# EasyEDA Pro project ProPrj_两相交错电源demo_2025-05-26.epro, board PCB1_1
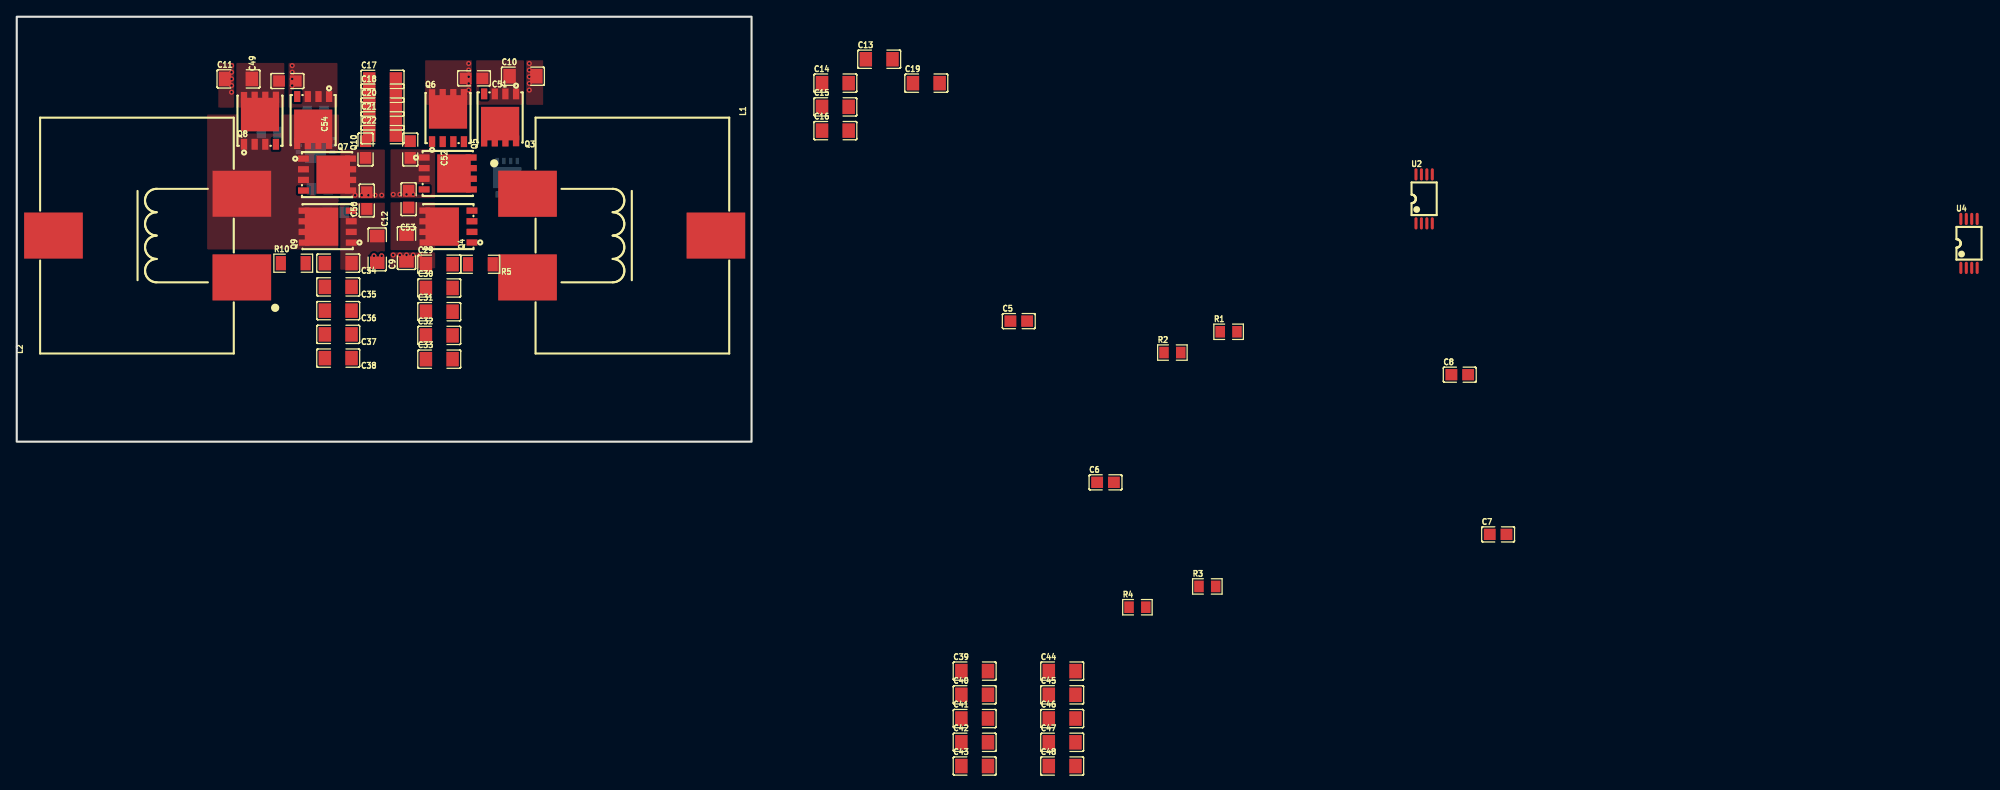
[diagram p9: board, top side]
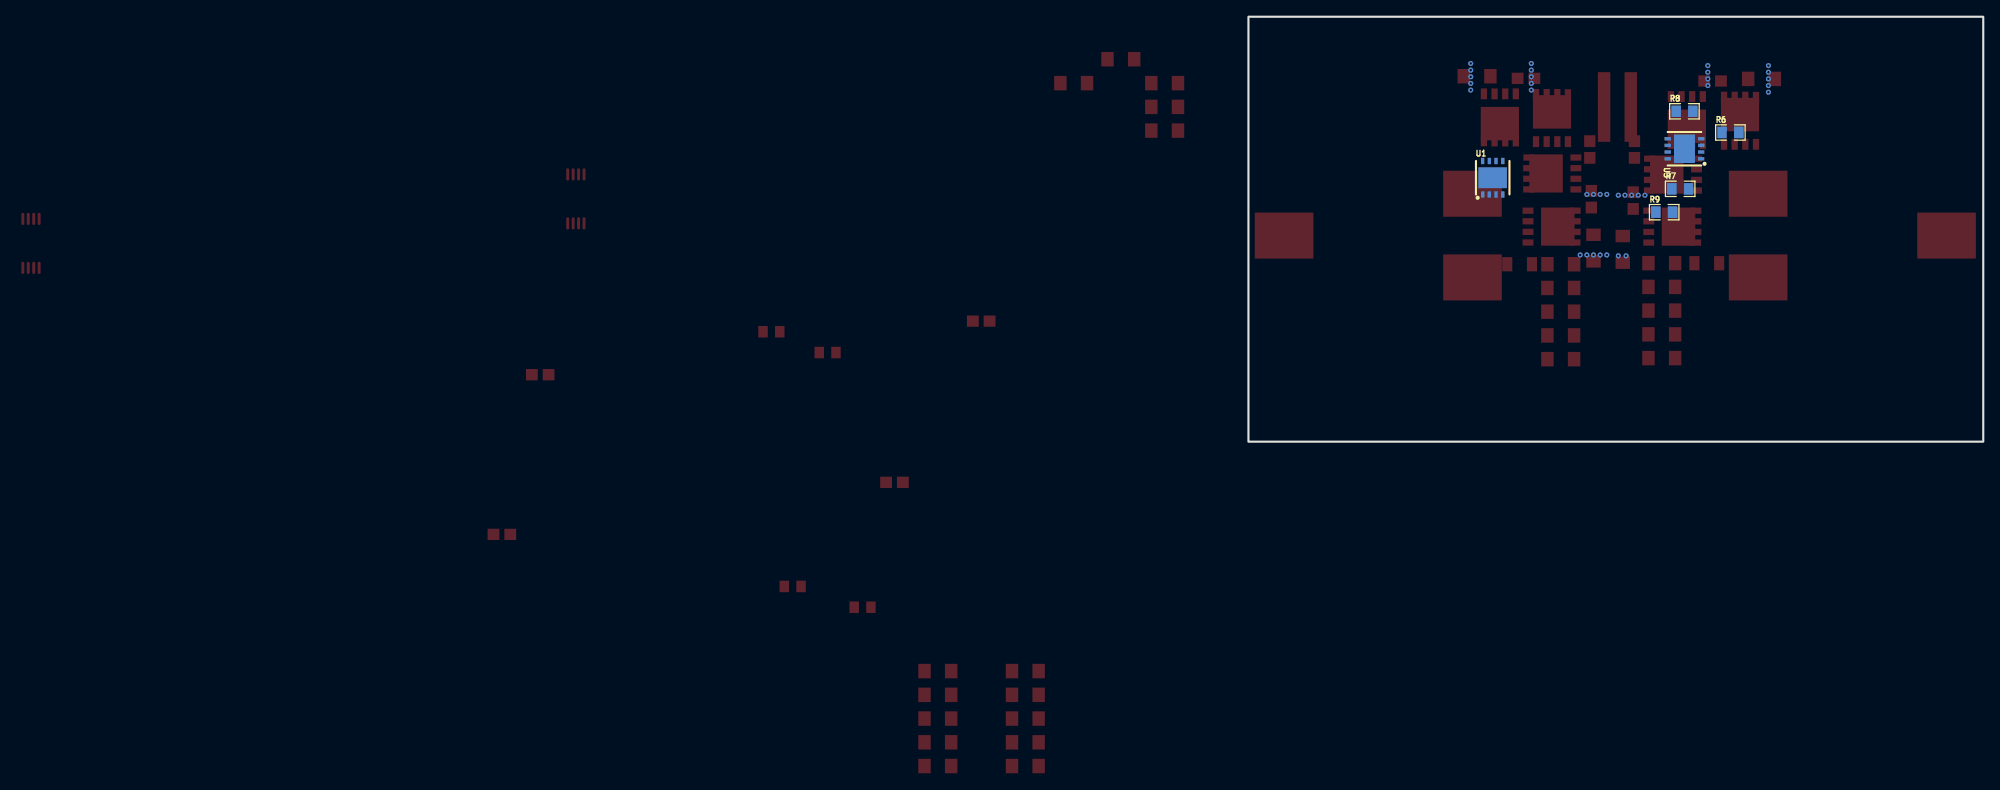
[diagram p10: board, bottom side, seen from below]

Outline 87.76 x 50.8 mm; copper layers: Top Layer, Inner1, Inner2, Bottom Layer. Coordinates in mm from the lower left corner of the outline.
Outline path: rectangle 0,50.8 87.76,0
Stack: Top Layer 0.035mm 外层铜厚1oz / Dielectric1 0.2104mm 7628 RC49% 8.6mil / Inner1 0.0152mm 内层铜厚 / Dielectric2 1.065mm 1.1mm H/HOZ Copper / Inner2 0.0152mm 内层铜厚 / Dielectric3 0.2104mm 7628 RC49% 8.6mil / Bottom Layer 0.035mm 外层铜厚1oz

## Design rules (mm)
template: 自定义配置
spacing copperThickness1oz (default): track to track 0.102, other pairs 0.152 to 0.3
spacing copperThickness2oz: track to track 0.203, other pairs 0.152 to 0.3
track width copperThickness1oz (default): min 0.127, default 0.254, max 2.54
track width copperThickness2oz: min 0.203, default 0.254, max 2.54
differential pair differentialPair (default): width min 0.127, default 0.254, max 2.54; gap min 0.152, default 0.152
via viaSize (default): diameter min 0.5, default 0.61, max 10; hole min 0.3, default 0.305, max 6.3

## Placement (name value [footprint] x y rotation side)
C5  100nF  [C0805]  119.67 14.41 0 top
C6  1uF  [C0805]  130.03 -4.86 0 top
C7  1uF  [C0805]  176.92 -11.08 0 top
C8  100nF  [C0805]  172.34 8.01 0 top
C9  100nF  [C1206]  46.55 23.15 90 top
C10  100nF  [C1206]  60.45 43.69 0 top
C11  100nF  [C1206]  26.48 43.37 0 top
C12  100nF  [C1206]  43.05 22.99 270 top
C13  100nF  [C1206]  103 45.72 0 top
C14  100nF  [C1206]  97.77 42.86 0 top
C15  100nF  [C1206]  97.77 40.02 0 top
C16  100nF  [C1206]  97.77 37.19 0 top
C17  100nF  [C1206]  43.69 43.31 0 top
C18  100nF  [C1206]  43.69 41.66 0 top
C19  100nF  [C1206]  108.62 42.86 0 top
C20  100nF  [C1206]  43.69 40 0 top
C21  100nF  [C1206]  43.69 38.35 0 top
C22  100nF  [C1206]  43.69 36.7 0 top
C29  100nF  [C1206]  50.46 21.21 0 top
C30  100nF  [C1206]  50.46 18.38 0 top
C31  100nF  [C1206]  50.46 15.54 0 top
C32  100nF  [C1206]  50.46 12.7 0 top
C33  100nF  [C1206]  50.46 9.86 0 top
C34  100nF  [C1206]  38.39 21.34 180 top
C35  100nF  [C1206]  38.39 18.5 180 top
C36  100nF  [C1206]  38.39 15.67 180 top
C37  100nF  [C1206]  38.39 12.83 180 top
C38  100nF  [C1206]  38.39 9.99 180 top
C39  100nF  [C1206]  114.4 -27.43 0 top
C40  100nF  [C1206]  114.4 -30.26 0 top
C41  100nF  [C1206]  114.4 -33.1 0 top
C42  100nF  [C1206]  114.4 -35.94 0 top
C43  100nF  [C1206]  114.4 -38.78 0 top
C44  100nF  [C1206]  124.85 -27.43 0 top
C45  100nF  [C1206]  124.85 -30.26 0 top
C46  100nF  [C1206]  124.85 -33.1 0 top
C47  100nF  [C1206]  124.85 -35.94 0 top
C48  100nF  [C1206]  124.85 -38.78 0 top
C49  2.2uF  [C0805]  32.32 43.11 180 top
C50  2.2uF  [C0805]  41.81 28.82 90 top
C51  2.2uF  [C0805]  54.61 43.43 180 top
C52  2.2uF  [C0805]  46.99 34.92 90 top
C53  2.2uF  [C0805]  46.8 28.99 270 top
C54  2.2uF  [C0805]  41.66 34.92 270 top
L1  15uH  [IND-SMD_3P-L28.0-W27.0_1]  71.5 24.64 270 top
L2  15uH  [IND-SMD_3P-L28.0-W27.0_1]  16.38 24.64 90 top
Q3  BSC026N08NS5  [PG-TDSON-8_L5.0-W6.0-P1.27-BL-EP]  57.73 38.76 180 top
Q4  BSC026N08NS5  [PG-TDSON-8_L5.0-W6.0-P1.27-BL-EP]  51.55 25.71 90 top
Q5  BSC026N08NS5  [PG-TDSON-8_L5.0-W6.0-P1.27-BL-EP]  51.48 32.06 270 top
Q6  BSC026N08NS5  [PG-TDSON-8_L5.0-W6.0-P1.27-BL-EP]  51.51 38.69 0 top
Q7  BSC026N08NS5  [PG-TDSON-8_L5.0-W6.0-P1.27-BL-EP]  35.4 38.44 180 top
Q8  BSC026N08NS5  [PG-TDSON-8_L5.0-W6.0-P1.27-BL-EP]  29.05 38.37 0 top
Q9  BSC026N08NS5  [PG-TDSON-8_L5.0-W6.0-P1.27-BL-EP]  37.13 25.71 90 top
Q10  BSC026N08NS5  [PG-TDSON-8_L5.0-W6.0-P1.27-BL-EP]  37.06 31.93 270 top
R1  4.7Ω  [R0805]  144.73 13.14 0 top
R2  4.7Ω  [R0805]  138.02 10.65 0 top
R3  4.7Ω  [R0805]  142.19 -17.3 0 top
R4  4.7Ω  [R0805]  133.84 -19.79 0 top
R5  1mΩ  [R1206]  55.37 21.21 180 top
R6  4.7Ω  [R0805]  30.2 36.96 180 bottom
R7  4.7Ω  [R0805]  36.2 30.23 180 bottom
R8  4.7Ω  [R0805]  35.69 39.5 180 bottom
R9  4.7Ω  [R0805]  38.11 27.43 180 bottom
R10  1mΩ  [R1206]  33.02 21.34 0 top
U1  UCC27211DRMT  [VSON-8_L4.0-W4.0-BL-EP]  58.58 31.55 180 bottom
U2  INA240A1QPWRQ1  [TSSOP-8_L4.4-W3.0-P0.65-LS6.4-BL]  168.08 29.03 0 top
U3  UCC27211DRMT  [VSON-8_L4.0-W4.0-BL-EP]  35.68 35.02 90 bottom
U4  INA240A1QPWRQ1  [TSSOP-8_L4.4-W3.0-P0.65-LS6.4-BL]  233.16 23.7 0 top

## Footprints (pads in the part's own frame, mm; a bottom-side part is the same pattern mirrored in y, then rotated)
C0805
  rect 1.41x1.35 smd: 1(-1,0) 2(1,0)
C1206
  rect 1.485x1.728 smd: 1(-1.593,0) 2(1.593,0)
IND-SMD_3P-L28.0-W27.0_1
  rect 5.5x7 smd: 1(-5,-10.5) 2(5,-10.5) 3(0,12)
PG-TDSON-8_L5.0-W6.0-P1.27-BL-EP
  rect 0.75x1.3 smd: 1(-1.905,-2.82) 2(-0.635,-2.82) 3(0.635,-2.82) 4(1.905,-2.82) 5(1.905,2.82) 6(0.635,2.82) 7(-0.635,2.82) 8(-1.905,2.794)
  rect 4.56x4 smd: 8(0,0.737)
R0805
  rect 1.133x1.377 smd: 1(-1,0) 2(1,0)
R1206
  rect 1.208x1.701 smd: 1(-1.479,0) 2(1.479,0)
TSSOP-8_L4.4-W3.0-P0.65-LS6.4-BL
  oval 0.353x1.454 smd: 1(-0.975,-2.927) 2(-0.325,-2.927) 3(0.325,-2.927) 4(0.975,-2.927) 5(0.975,2.927) 6(0.325,2.927) 7(-0.325,2.927) 8(-0.975,2.927)
VSON-8_L4.0-W4.0-BL-EP
  rect 0.4x0.75 smd: 1(-1.2,-2) 2(-0.4,-2) 3(0.4,-2) 4(1.2,-2) 5(1.2,2) 6(0.4,2) 7(-0.4,2) 8(-1.2,2)
  rect 3.4x2.5 smd: 9(0,0)

## Nets
As in the schematic.

Pads without a net: L1 3; L2 3; U1 5 6 9; U2 1 2 3 4 5 6 7 8; U3 5 6 9; U4 1 2 3 4 5 6 7 8

## Via types
v1: diameter 0.61, hole 0.305, Top Layer to Bottom Layer, 35 vias

## Routing (per net, layer and track width the routed paths; a pad name or vN(x,y) marks a point on that pad's centre or on a via; arc(x,y) is an arc through that point)
GND:
  vias: v1(25.66,44.96) v1(25.66,44.16) v1(25.66,43.37) v1(25.66,42.57) v1(25.66,41.78) v1(32.9,44.96) v1(32.9,44.16) v1(32.9,43.37) v1(32.9,42.57) v1(44.96,29.56) v1(44.96,22.32) v1(45.75,29.56) v1(45.75,22.32) v1(46.55,29.56) v1(46.55,22.32) v1(47.34,29.56) v1(47.34,22.32) v1(48.14,22.32)
VCC:
  vias: v1(40.41,29.46) v1(41.2,29.46) v1(41.99,29.46) v1(42.66,22.22) v1(42.79,29.46) v1(43.58,29.46) v1(43.58,22.22) v1(53.98,45.21) v1(53.98,44.42) v1(53.98,43.62) v1(53.98,42.83) v1(53.98,42.03) v1(61.21,45.21) v1(61.21,44.42) v1(61.21,43.62) v1(61.21,42.83) v1(61.21,42.03)

## Copper pours and planes (outline as drawn; the poured copper is in the pictures)
GND on Top Layer: 24.07,45.27 25.97,45.27 25.97,39.94 24.07,39.94
GND on Top Layer: 44.64,29.11 44.64,34.96 49.98,34.96 49.98,29.11
GND on Top Layer: 32.45,45.27 38.29,45.27 38.29,39.94 32.45,39.94
GND on Top Layer: 43.96,28.57 43.96,20.57 38.63,20.57 38.63,28.57
GND on Top Layer: 44.64,20.73 44.64,22.64 49.98,22.64 49.98,20.73
GND on Top Layer: 54.86,45.59 60.58,45.59 60.58,40.26 54.86,40.26
GND on Inner1: 44.64,20.82 44.64,34.91 49.98,34.91 49.98,20.82
GND on Inner1: 24.15,45.27 38.25,45.27 38.25,39.94 24.15,39.94
VCC on Top Layer: 44.64,22.89 44.64,28.61 49.98,28.61 49.98,22.89
VCC on Top Layer: 43.96,34.92 43.96,29.08 38.63,29.08 38.63,34.92
VCC on Top Layer: 26.23,45.27 31.94,45.27 31.94,39.94 26.23,39.94
VCC on Top Layer: 48.77,45.59 54.36,45.59 54.36,40.26 48.77,40.26
VCC on Top Layer: 43.96,22.6 43.96,20.57 42.06,20.57 42.06,22.6
VCC on Top Layer: 60.83,45.59 62.86,45.59 62.86,40.26 60.83,40.26
VCC on Inner1: 48.77,45.59 62.86,45.59 62.86,40.26 48.77,40.26
VCC on Inner1: 43.96,34.92 43.96,20.57 38.63,20.57 38.63,34.92
$1N2653 on Top Layer: 22.73,39.12 38.48,39.12 38.48,22.99 22.73,22.99
